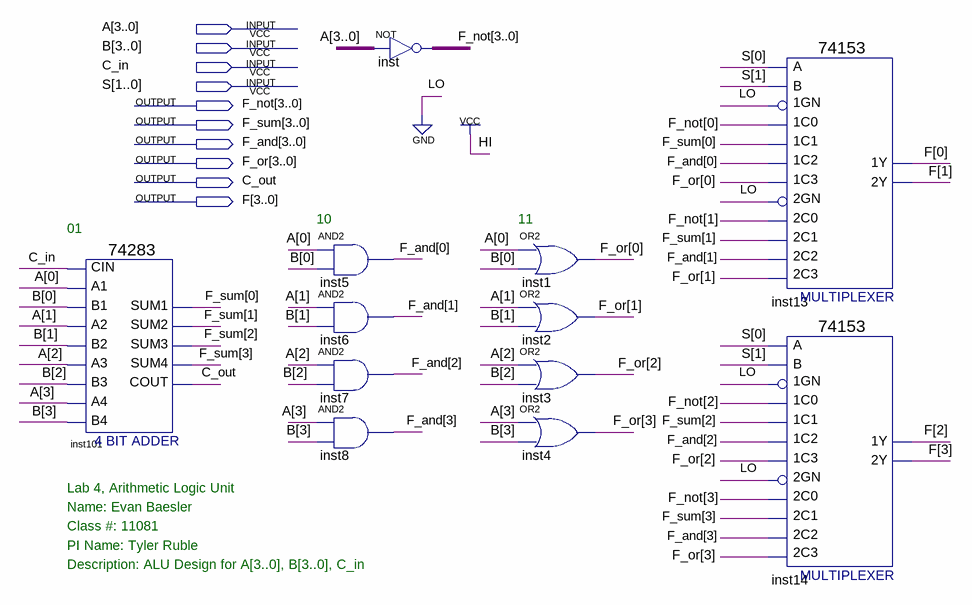
[diagram p0: schematic sheet]
// Quartus schematic lab4_ALU.bdf as structural Verilog: 12 symbols, 10 pins
module lab4_ALU (
  input  [3:0] A,
  input  [3:0] B,
  input  C_in,
  input  [1:0] S,
  output [3:0] F_not,
  output [3:0] F_sum,
  output [3:0] F_and,
  output [3:0] F_or,
  output C_out,
  output [3:0] F
);

  \74283  inst101 (
    .CIN(C_in), .A1(A[0]), .A2(A[1]), .B2(B[1]), .A3(A[2]), .A4(A[3]), .B4(B[3]), .B1(B[0]), .B3(B[2]),
    .SUM4(F_sum[3]), .COUT(C_out), .SUM1(F_sum[0]), .SUM2(F_sum[1]), .SUM3(F_sum[2]));
  and inst5 (F_and[0], A[0], B[0]);
  and inst6 (F_and[1], A[1], B[1]);
  and inst7 (F_and[2], A[2], B[2]);
  and inst8 (F_and[3], A[3], B[3]);
  assign F_not = ~A;  // NOT inst, 4 bits wide
  or inst1 (F_or[0], A[0], B[0]);
  or inst2 (F_or[1], A[1], B[1]);
  or inst3 (F_or[2], A[2], B[2]);
  or inst4 (F_or[3], A[3], B[3]);
  \74153  inst13 (
    .\1C1 (F_sum[0]), .\1GN (1'b0), .\1C0 (F_not[0]), .\2C0 (F_not[1]), .\2GN (1'b0), .\2C2 (F_and[1]),
    .\1C2 (F_and[0]), .\1C3 (F_or[0]), .B(S[1]), .A(S[0]), .\2C1 (F_sum[1]), .\2C3 (F_or[1]), .\1Y (F[0]),
    .\2Y (F[1]));
  \74153  inst14 (
    .\1C1 (F_sum[2]), .\1GN (1'b0), .\1C0 (F_not[2]), .\2C0 (F_not[3]), .\2GN (1'b0), .\2C2 (F_and[3]),
    .\1C2 (F_and[2]), .\1C3 (F_or[2]), .B(S[1]), .A(S[0]), .\2C1 (F_sum[3]), .\2C3 (F_or[3]), .\1Y (F[2]),
    .\2Y (F[3]));

  // Notes on the sheet:
  //   10
  //   11
  //   01
  //   Lab 4, Arithmetic Logic Unit
  //   Name: Evan Baesler
  //   Class #: 11081
  //   PI Name: Tyler Ruble
  //   Description: ALU Design for A[3..0], B[3..0], C_in
endmodule
